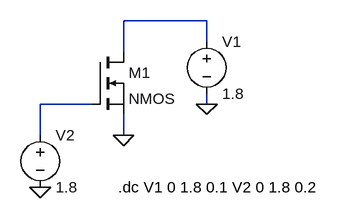
[diagram p0: schematic nmos_exp1 vanisha.asc]
nmos_exp1 vanisha.asc, the LTspice schematic file:
Version 4
SHEET 1 880 680
WIRE 368 48 240 48
WIRE 368 80 368 48
WIRE 240 96 240 48
WIRE 192 176 112 176
WIRE 368 176 368 160
WIRE 112 224 112 176
WIRE 240 224 240 192
FLAG 240 224 0
FLAG 368 176 0
FLAG 112 304 0
SYMBOL nmos 192 96 R0
SYMATTR InstName M1
SYMBOL voltage 368 64 R0
SYMATTR InstName V1
SYMATTR Value 1.8
SYMBOL voltage 112 208 R0
SYMATTR InstName V2
SYMATTR Value 1.8
TEXT 232 304 Left 2 !.dc V1 0 1.8 0.1 V2 0 1.8 0.2

The netlist it stands for:
* nmos_exp1 vanisha.asc
M1 N001 N002 0 0 NMOS
V1 N001 0 1.8
V2 N002 0 1.8
.model NMOS NMOS
.model PMOS PMOS
.lib standard.mos
.dc V1 0 1.8 0.1 V2 0 1.8 0.2
.backanno
.end